# EAGLE design USB3 Hub (EAGLE 6.6.0)
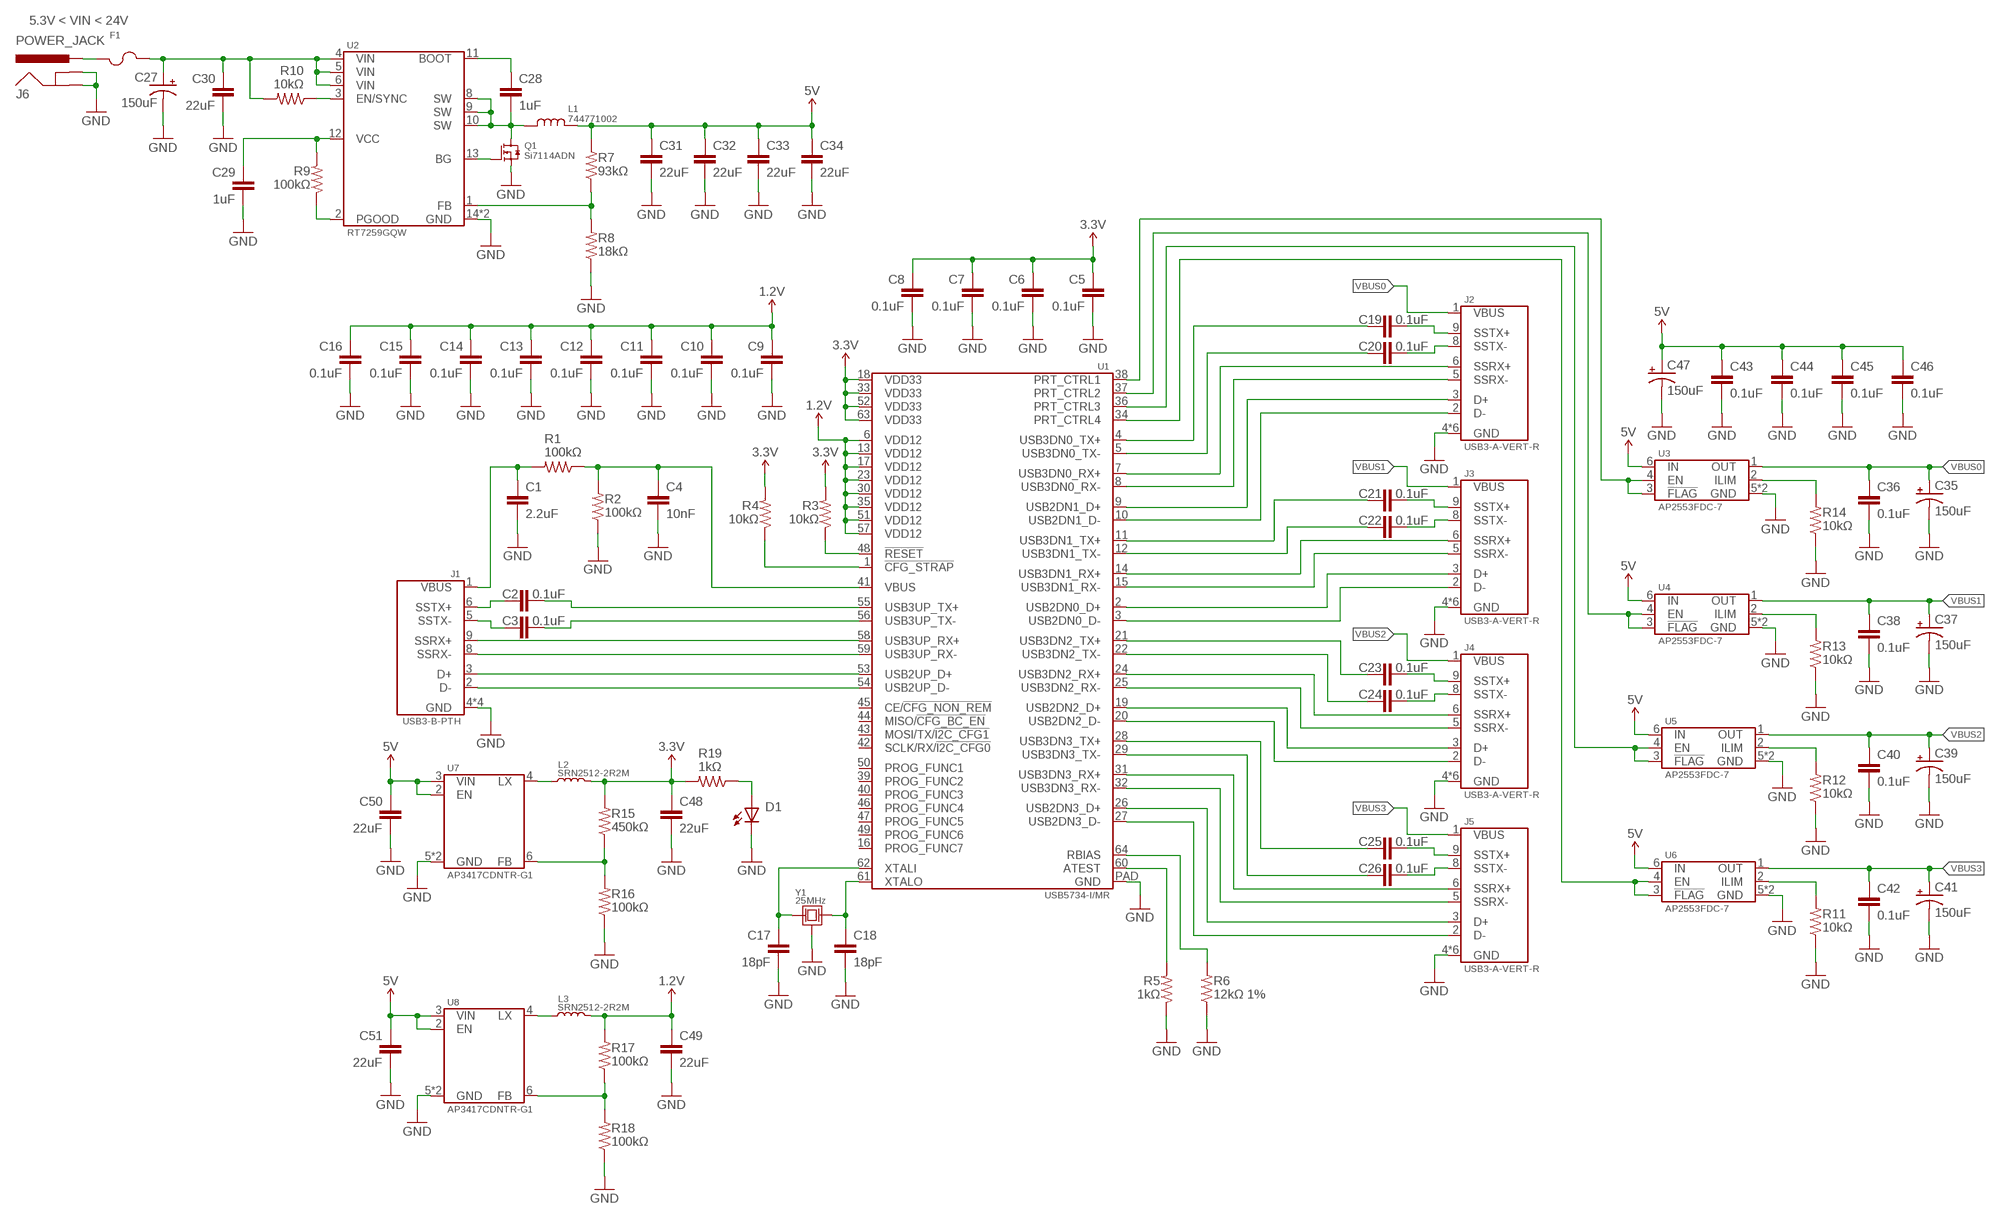
[diagram p0: schematic, sheet 1]

## Parts
C1  2.2uF  CAP-0603  [0603-CAP]
C2  0.1uF  CAP-0603  [0603-CAP]
C3  0.1uF  CAP-0603  [0603-CAP]
C4  10nF  CAP-0603  [0603-CAP]
C5  0.1uF  CAP-0603  [0603-CAP]
C6  0.1uF  CAP-0603  [0603-CAP]
C7  0.1uF  CAP-0603  [0603-CAP]
C8  0.1uF  CAP-0603  [0603-CAP]
C9  0.1uF  CAP-0603  [0603-CAP]
C10  0.1uF  CAP-0603  [0603-CAP]
C11  0.1uF  CAP-0603  [0603-CAP]
C12  0.1uF  CAP-0603  [0603-CAP]
C13  0.1uF  CAP-0603  [0603-CAP]
C14  0.1uF  CAP-0603  [0603-CAP]
C15  0.1uF  CAP-0603  [0603-CAP]
C16  0.1uF  CAP-0603  [0603-CAP]
C17  18pF  CAP-0603  [0603-CAP]
C18  18pF  CAP-0603  [0603-CAP]
C19  0.1uF  CAP-0603  [0603-CAP]
C20  0.1uF  CAP-0603  [0603-CAP]
C21  0.1uF  CAP-0603  [0603-CAP]
C22  0.1uF  CAP-0603  [0603-CAP]
C23  0.1uF  CAP-0603  [0603-CAP]
C24  0.1uF  CAP-0603  [0603-CAP]
C25  0.1uF  CAP-0603  [0603-CAP]
C26  0.1uF  CAP-0603  [0603-CAP]
C27  150uF  CAP_POL-6.6X6.6  [CAP_POL-6.6X6.6]
C28  1uF  CAP-0603  [0603-CAP]
C29  1uF  CAP-0603  [0603-CAP]
C30  22uF  CAP-0603  [0603-CAP]
C31  22uF  CAP-0603  [0603-CAP]
C32  22uF  CAP-0603  [0603-CAP]
C33  22uF  CAP-0603  [0603-CAP]
C34  22uF  CAP-0603  [0603-CAP]
C35  150uF  CAP_POL-6.6X6.6  [CAP_POL-6.6X6.6]
C36  0.1uF  CAP-0603  [0603-CAP]
C37  150uF  CAP_POL-6.6X6.6  [CAP_POL-6.6X6.6]
C38  0.1uF  CAP-0603  [0603-CAP]
C39  150uF  CAP_POL-6.6X6.6  [CAP_POL-6.6X6.6]
C40  0.1uF  CAP-0603  [0603-CAP]
C41  150uF  CAP_POL-6.6X6.6  [CAP_POL-6.6X6.6]
C42  0.1uF  CAP-0603  [0603-CAP]
C43  0.1uF  CAP-0603  [0603-CAP]
C44  0.1uF  CAP-0603  [0603-CAP]
C45  0.1uF  CAP-0603  [0603-CAP]
C46  0.1uF  CAP-0603  [0603-CAP]
C47  150uF  CAP_POL-6.6X6.6  [CAP_POL-6.6X6.6]
C48  22uF  CAP-0603  [0603-CAP]
C49  22uF  CAP-0603  [0603-CAP]
C50  22uF  CAP-0603  [0603-CAP]
C51  22uF  CAP-0603  [0603-CAP]
D1  LED-0805  [0805-LED]
F1  PTC-1812  [1812-PTC]
J1  USB3-B-PTH  [GSB4211311WEU]
J2  USB3-A-VERT-R  [GSB4116341HR]
J3  USB3-A-VERT-R  [GSB4116341HR]
J4  USB3-A-VERT-R  [GSB4116341HR]
J5  USB3-A-VERT-R  [GSB4116341HR]
J6  POWER_JACK  [BARREL-POWER_2.1MMX5.5MM]
L1  744771002  INDUCTOR-744771002  [744771002]
L2  SRN2512-2R2M  [SRN2512]
L3  SRN2512-2R2M  [SRN2512]
Q1  Si7114ADN  N-MOSFET  [POWERPAK]
R1  100kΩ  RESISTOR-0603  [0603-CAP]
R2  100kΩ  RESISTOR-0603  [0603-CAP]
R3  10kΩ  RESISTOR-0603  [0603-CAP]
R4  10kΩ  RESISTOR-0603  [0603-CAP]
R5  1kΩ  RESISTOR-0603  [0603-CAP]
R6  12kΩ 1%  RESISTOR-0603  [0603-CAP]
R7  93kΩ  RESISTOR-0603  [0603-CAP]
R8  18kΩ  RESISTOR-0603  [0603-CAP]
R9  100kΩ  RESISTOR-0603  [0603-CAP]
R10  10kΩ  RESISTOR-0603  [0603-CAP]
R11  10kΩ  RESISTOR-0603  [0603-CAP]
R12  10kΩ  RESISTOR-0603  [0603-CAP]
R13  10kΩ  RESISTOR-0603  [0603-CAP]
R14  10kΩ  RESISTOR-0603  [0603-CAP]
R15  450kΩ  RESISTOR-0603  [0603-CAP]
R16  100kΩ  RESISTOR-0603  [0603-CAP]
R17  100kΩ  RESISTOR-0603  [0603-CAP]
R18  100kΩ  RESISTOR-0603  [0603-CAP]
R19  1kΩ  RESISTOR-0603  [0603-CAP]
U1  USB5734-I/MR  [VQFN-64-9MM]
U2  RT7259GQW  [WDFN-14-4X3]
U3  AP2553FDC-7  [UDFN6-2020]
U4  AP2553FDC-7  [UDFN6-2020]
U5  AP2553FDC-7  [UDFN6-2020]
U6  AP2553FDC-7  [UDFN6-2020]
U7  AP3417CDNTR-G1  [UDFN6-2020]
U8  AP3417CDNTR-G1  [UDFN6-2020]
Y1  25MHz  CRYSTAL-3.2X2.5  [FA-238]

## Nets
1.2V: C9.1 C10.1 C11.1 C12.1 C13.1 C14.1 C15.1 C16.1 C49.1 L3.2 R17.2 U1.6(VDD12) U1.13(VDD12) U1.17(VDD12) U1.23(VDD12) U1.30(VDD12) U1.35(VDD12) U1.51(VDD12) U1.57(VDD12)
3.3V: C5.1 C6.1 C7.1 C8.1 C48.1 L2.2 R3.2 R4.2 R15.2 R19.2 U1.18(VDD33) U1.33(VDD33) U1.52(VDD33) U1.63(VDD33)
5V: C31.1 C32.1 C33.1 C34.1 C43.1 C44.1 C45.1 C46.1 C47.+ C50.1 C51.1 L1.P$2 R7.2 U3.6(IN) U4.6(IN) U5.6(IN) U6.6(IN) U7.2(EN) U7.3(VIN) U8.2(EN) U8.3(VIN)
_T0_N: C20.2 J2.8(SSTX-)
_T0_P: C19.2 J2.9(SSTX+)
_T1_N: C22.2 J3.8(SSTX-)
_T1_P: C21.2 J3.9(SSTX+)
_T2_N: C24.2 J4.8(SSTX-)
_T2_P: C23.2 J4.9(SSTX+)
_T3_N: C26.2 J5.8(SSTX-)
_T3_P: C25.2 J5.9(SSTX+)
_T_N: C3.1 J1.5(SSTX-)
_T_P: C2.1 J1.6(SSTX+)
D0_N: J2.2(D-) U1.10(USB2DN1_D-)
D0_P: J2.3(D+) U1.9(USB2DN1_D+)
D1_N: J3.2(D-) U1.3(USB2DN0_D-)
D1_P: J3.3(D+) U1.2(USB2DN0_D+)
D2_N: J4.2(D-) U1.20(USB2DN2_D-)
D2_P: J4.3(D+) U1.19(USB2DN2_D+)
D3_N: J5.2(D-) U1.27(USB2DN3_D-)
D3_P: J5.3(D+) U1.26(USB2DN3_D+)
D_N: J1.2(D-) U1.54(USB2UP_D-)
D_P: J1.3(D+) U1.53(USB2UP_D+)
GND: C1.2 C4.2 C5.2 C6.2 C7.2 C8.2 C9.2 C10.2 C11.2 C12.2 C13.2 C14.2 C15.2 C16.2 C17.2 C18.2 C27.- C29.2 C30.2 C31.2 C32.2 C33.2 C34.2 C35.- C36.2 C37.- C38.2 C39.- C40.2 C41.- C42.2 C43.2 C44.2 C45.2 C46.2 C47.- C48.2 C49.2 C50.2 C51.2 D1.C J1.4(GND) J1.7(GND) J1.P$10(GND) J1.P$11(GND) J2.4(GND) J2.7(GND) J2.P$1(GND) J2.P$2(GND) J2.P$3(GND) J2.P$4(GND) J3.4(GND) J3.7(GND) J3.P$1(GND) J3.P$2(GND) J3.P$3(GND) J3.P$4(GND) J4.4(GND) J4.7(GND) J4.P$1(GND) J4.P$2(GND) J4.P$3(GND) J4.P$4(GND) J5.4(GND) J5.7(GND) J5.P$1(GND) J5.P$2(GND) J5.P$3(GND) J5.P$4(GND) J6.2(GND) J6.3(GNDBREAK) Q1.1(SOURCE) Q1.2(SOURCE) Q1.3(SOURCE) R2.1 R5.1 R6.1 R8.1 R11.1 R12.1 R13.1 R14.1 R16.1 R18.1 U1.PAD(GND) U2.14(GND) U2.PAD(GND) U3.5(GND) U3.PAD(GND) U4.5(GND) U4.PAD(GND) U5.5(GND) U5.PAD(GND) U6.5(GND) U6.PAD(GND) U7.5(GND) U7.PAD(GND) U8.5(GND) U8.PAD(GND) Y1.2(GND) Y1.4(GND)
N$1: F1.1 J6.1(PWR)
N$2: C27.+ C30.1 F1.2 R10.2 U2.4(VIN) U2.5(VIN) U2.6(VIN)
N$3: R7.1 R8.2 U2.1(FB)
N$4: Q1.4(GATE) U2.13(BG)
N$5: C1.1 J1.1(VBUS) R1.2
N$6: R12.2 U5.2(ILIM)
N$7: C28.2 L1.P$1 Q1.5(DRAIN) Q1.6(DRAIN) Q1.7(DRAIN) Q1.8(DRAIN) Q1.9(DRAIN) Q1.10(DRAIN) Q1.11(DRAIN) U2.8(SW) U2.9(SW) U2.10(SW)
N$8: C28.1 U2.11(BOOT)
N$9: C29.1 R9.2 U2.12(VCC)
N$10: C4.1 R1.1 R2.2 U1.41(VBUS)
N$11: R9.1 U2.2(PGOOD)
N$12: R3.1 U1.48(!RESET)
N$13: R4.1 U1.1(!CFG_STRAP)
N$14: C17.1 U1.62(XTALI) Y1.1
N$15: C18.1 U1.61(XTALO) Y1.3
N$16: R5.2 U1.60(ATEST)
N$17: R6.2 U1.64(RBIAS)
N$18: R10.1 U2.3(EN/SYNC)
N$19: R11.2 U6.2(ILIM)
N$20: L3.1 U8.4(LX)
N$22: U1.36(PRT_CTRL3) U5.3(!FLAG) U5.4(EN)
N$23: U1.38(PRT_CTRL1) U3.3(!FLAG) U3.4(EN)
N$24: U1.37(PRT_CTRL2) U4.3(!FLAG) U4.4(EN)
N$25: R14.2 U3.2(ILIM)
N$26: R17.1 R18.2 U8.6(FB)
N$27: L2.1 U7.4(LX)
N$28: R13.2 U4.2(ILIM)
N$29: U1.34(PRT_CTRL4) U6.3(!FLAG) U6.4(EN)
N$31: R15.1 R16.2 U7.6(FB)
N$35: D1.A R19.1
R0_N: J2.5(SSRX-) U1.8(USB3DN0_RX-)
R0_P: J2.6(SSRX+) U1.7(USB3DN0_RX+)
R1_N: J3.5(SSRX-) U1.15(USB3DN1_RX-)
R1_P: J3.6(SSRX+) U1.14(USB3DN1_RX+)
R2_N: J4.5(SSRX-) U1.25(USB3DN2_RX-)
R2_P: J4.6(SSRX+) U1.24(USB3DN2_RX+)
R3_N: J5.5(SSRX-) U1.32(USB3DN3_RX-)
R3_P: J5.6(SSRX+) U1.31(USB3DN3_RX+)
R_N: J1.8(SSRX-) U1.59(USB3UP_RX-)
R_P: J1.9(SSRX+) U1.58(USB3UP_RX+)
T0_N: C20.1 U1.5(USB3DN0_TX-)
T0_P: C19.1 U1.4(USB3DN0_TX+)
T1_N: C22.1 U1.12(USB3DN1_TX-)
T1_P: C21.1 U1.11(USB3DN1_TX+)
T2_N: C24.1 U1.22(USB3DN2_TX-)
T2_P: C23.1 U1.21(USB3DN2_TX+)
T3_N: C26.1 U1.29(USB3DN3_TX-)
T3_P: C25.1 U1.28(USB3DN3_TX+)
T_N: C3.2 U1.56(USB3UP_TX-)
T_P: C2.2 U1.55(USB3UP_TX+)
VBUS0: C35.+ C36.1 J2.1(VBUS) U3.1(OUT)
VBUS1: C37.+ C38.1 J3.1(VBUS) U4.1(OUT)
VBUS2: C39.+ C40.1 J4.1(VBUS) U5.1(OUT)
VBUS3: C41.+ C42.1 J5.1(VBUS) U6.1(OUT)
Unconnected: U1.16(PROG_FUNC7) U1.39(PROG_FUNC2) U1.40(PROG_FUNC3) U1.42(SCLK/RX/!I2C_CFG0) U1.43(MOSI/TX/!I2C_CFG1) U1.44(MISO/!CFG_BC_EN) U1.45(CE/!CFG_NON_REM) U1.46(PROG_FUNC4) U1.47(PROG_FUNC5) U1.49(PROG_FUNC6) U1.50(PROG_FUNC1)

## Notes on the sheet
- 5.3V < VIN < 24V

## Library data of the parts
C1-C26 C28-C34 C36 C38 C40 C42-C46 C48-C51 = Passives:CAP
C27 C35 C37 C39 C41 C47 = Passives:CAP_POL
D1 = Passives:LED
F1 = Passives:PTC
J1-J5 = Connectors:USB3
J6 = Connectors:POWER_JACK
L1 = Passives:INDUCTOR
L2 L3 = Bourns:SRN2512-2R2M
Q1 = Passives:N-MOSFET
R1-R19 = Passives:RESISTOR
U1 = Microchip:USB5734
U2 = Richtek:RT7259
U3-U6 = Diodes:AP2553
U7 U8 = Diodes:AP3417C
Y1 = Passives:CRYSTAL

## Board
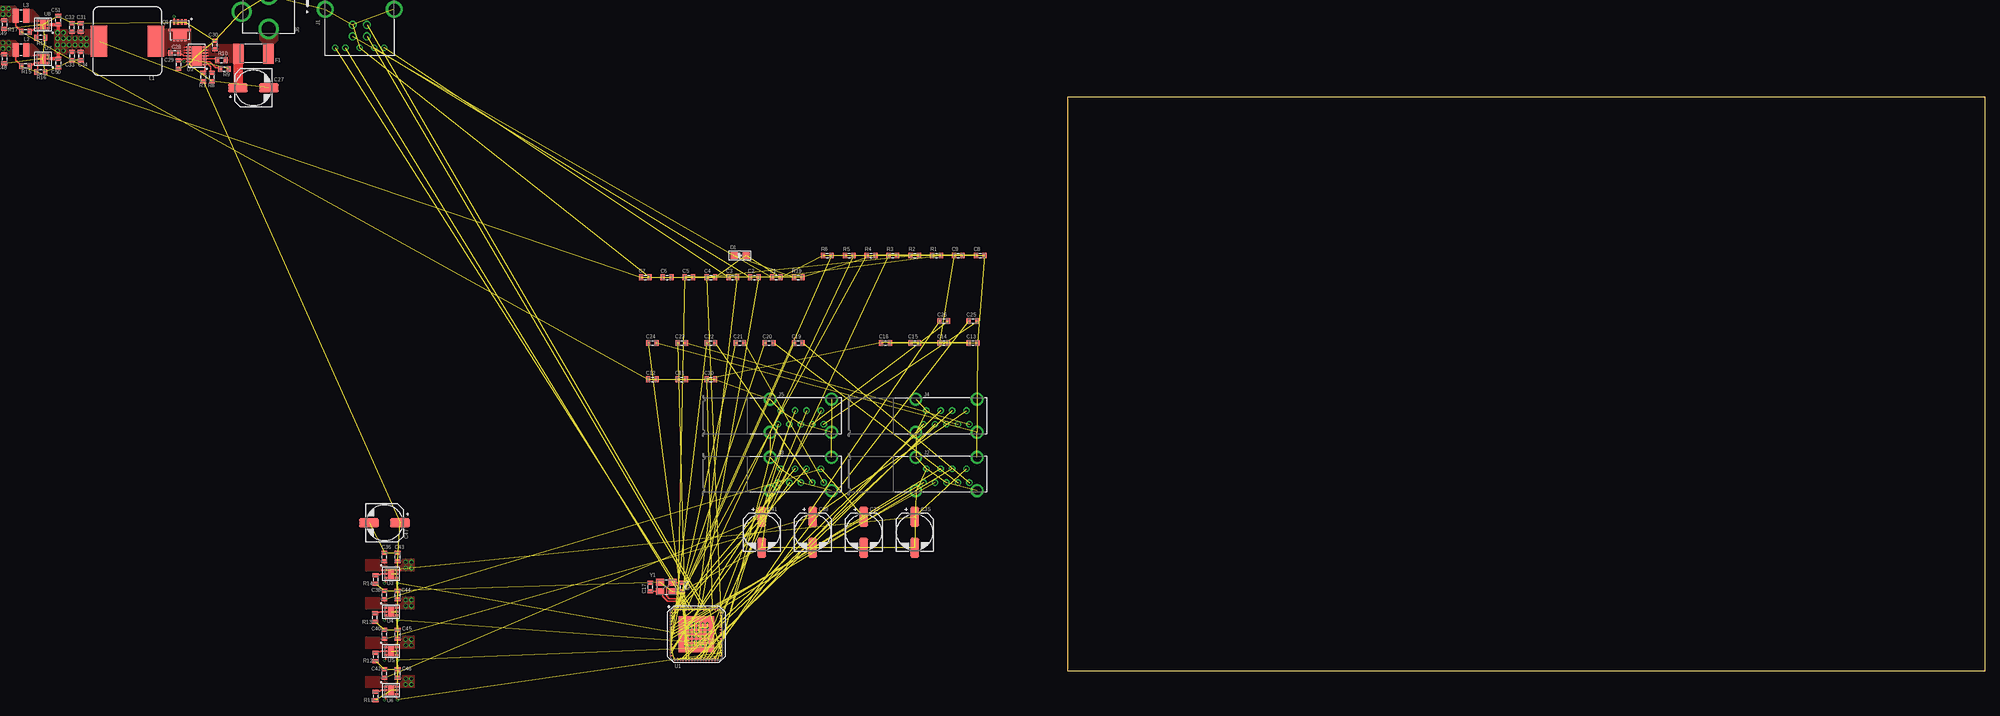
[diagram p1: board, top side]
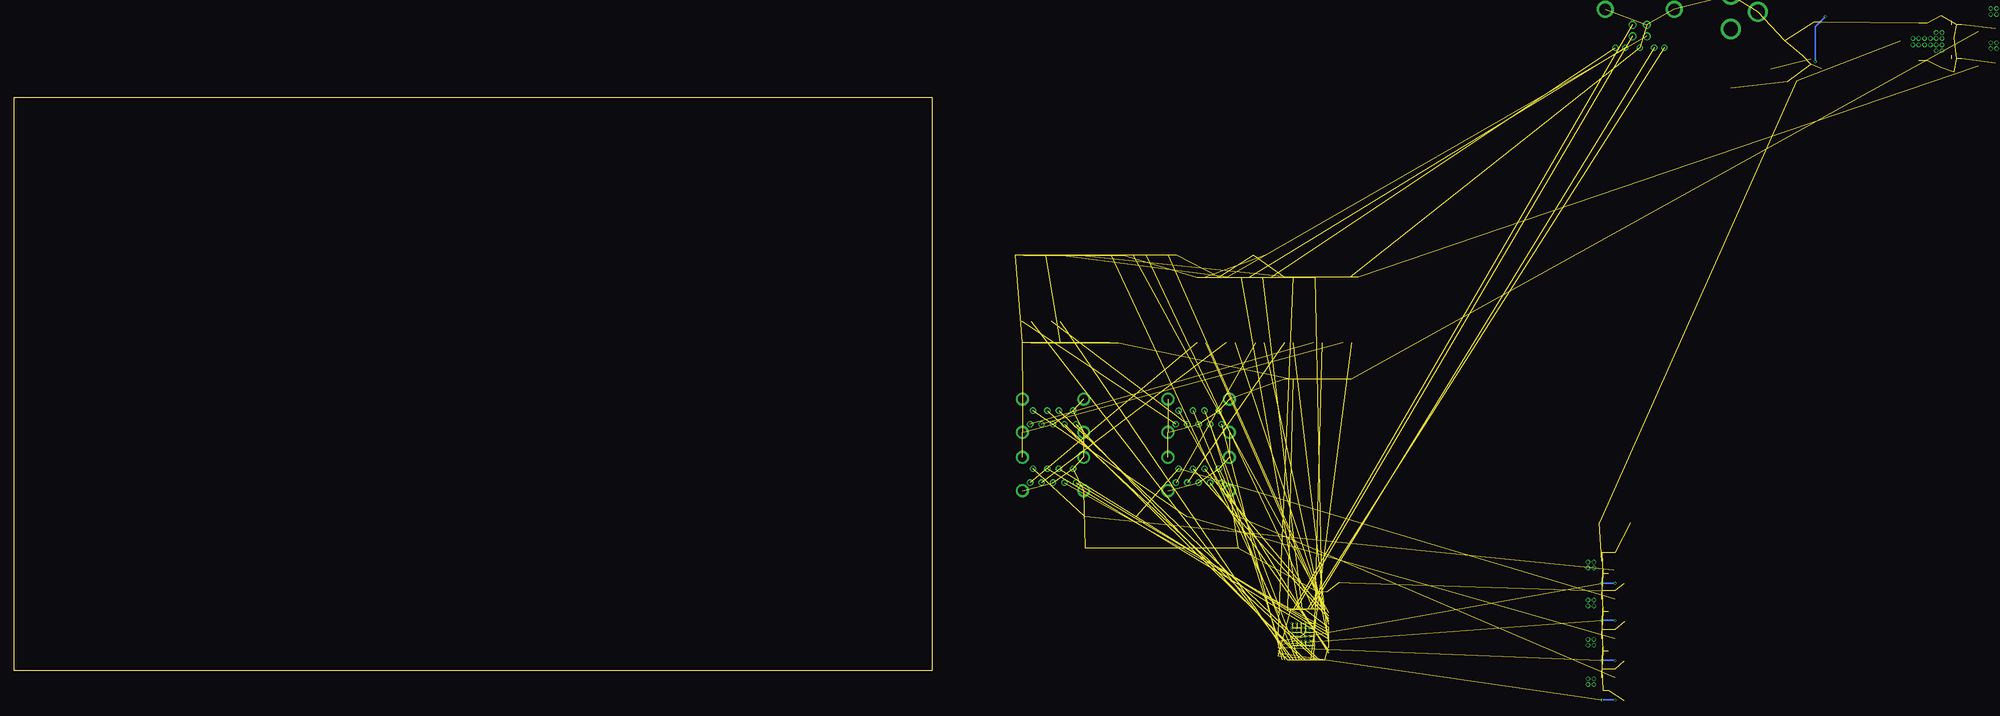
[diagram p2: board, bottom side, seen from below]

Size 160 x 100 mm. Coordinates in mm from the lower left corner, seen from the top.
Outline: 0,0 160,0 160,100 0,100 0,0
Copper layers (1*2*15*16): Top 0.035559375mm / dielectric 0.17018125mm / Route2 0.01778125mm / dielectric 47mil / Route15 0.01778125mm / dielectric 0.17018125mm / Bottom 0.035559375mm
Design rules "OSHPark-4layer *": minimum track width 5mil, minimum drill 10mil, track to track 5mil, track to pad 5mil, pad to pad 5mil, via to via 5mil, smd to smd 5mil, copper to edge 15mil, drill to drill 6mil, minimum pad ring 4mil, minimum via ring 4mil, stop-mask expansion 2.5mil, vias tented up to drill 20mil, thermal gap 10mil

### Footprints (pad centres in the part's own frame; a part is rotated, then mirrored left to right if it is on the bottom)
0603-CAP = smd 0.7 x 1: 1 -0.75,0; 2 0.75,0
CAP_POL-6.6X6.6 = smd 1.6 x 3.5: + 0,2.7; - 0,-2.7
0805-LED = smd 1.2 x 1.2: A -1.05,0; C 1.05,0
1812-PTC = smd 1.78 x 3.5: 1 -2.615,0; 2 2.615,0
GSB4211311WEU = drill 0.92: 1 1.25,-2; 2 -1.25,-2; 3 -1.25,-4; 4 1.25,-4 | drill 0.7: 5 -4.25,0; 6 -2.5,0; 7 0,0; 8 2.5,0; 9 4.25,0 | drill 2: P$10 -6.02,-6.71; P$11 6.02,-6.71
GSB4116341HR = drill 0.7 pad 1.1: 1 12.85,0.9; 2 10.35,0.9; 3 8.35,0.9; 4 5.85,0.9; 5 5.35,-1.5; 6 7.35,-1.5; 7 9.35,-1.5; 8 11.35,-1.5; 9 13.35,-1.5 | drill 1.5 pad 2.1: P$1 14.7,2.9; P$2 4,2.9; P$3 4,-2.9; P$4 14.7,-2.9
BARREL-POWER_2.1MMX5.5MM = drill 2.5: 1 0,-6.5; 2 0,-0.5; 3 -4.7,-3.5
744771002 = smd 2.9 x 5.4: P$1 -4.95,0; P$2 4.95,0
SRN2512 = smd 1.05 x 2.4: 1 -0.925,0; 2 0.925,0
POWERPAK = smd 0.991 x 0.406: 1 -1.435,0.991; 2 -1.435,0.33; 3 -1.435,-0.33; 4 -1.435,-0.991 | smd 0.457 x 0.737: 5 -0.076,-1.562; 10 -0.076,1.562 | smd 0.508 x 0.406: 6 1.676,-0.991; 7 1.676,-0.33; 8 1.676,0.33; 9 1.676,0.991 | smd 1.727 x 2.388: 11 0.559,0
VQFN-64-9MM = smd 0.7 x 0.3: 1 -4.4,3.75; 2 -4.4,3.25; 3 -4.4,2.75; 4 -4.4,2.25; 5 -4.4,1.75; 6 -4.4,1.25; 7 -4.4,0.75; 8 -4.4,0.25; 9 -4.4,-0.25; 10 -4.4,-0.75; 11 -4.4,-1.25; 12 -4.4,-1.75; 13 -4.4,-2.25; 14 -4.4,-2.75; 15 -4.4,-3.25; 16 -4.4,-3.75; 33 4.4,-3.75; 34 4.4,-3.25; 35 4.4,-2.75; 36 4.4,-2.25; 37 4.4,-1.75; 38 4.4,-1.25; 39 4.4,-0.75; 40 4.4,-0.25; 41 4.4,0.25; 42 4.4,0.75; 43 4.4,1.25; 44 4.4,1.75; 45 4.4,2.25; 46 4.4,2.75; 47 4.4,3.25; 48 4.4,3.75 | smd 0.3 x 0.7: 17 -3.75,-4.4; 18 -3.25,-4.4; 19 -2.75,-4.4; 20 -2.25,-4.4; 21 -1.75,-4.4; 22 -1.25,-4.4; 23 -0.75,-4.4; 24 -0.25,-4.4; 25 0.25,-4.4; 26 0.75,-4.4; 27 1.25,-4.4; 28 1.75,-4.4; 29 2.25,-4.4; 30 2.75,-4.4; 31 3.25,-4.4; 32 3.75,-4.4; 49 3.75,4.4; 50 3.25,4.4; 51 2.75,4.4; 52 2.25,4.4; 53 1.75,4.4; 54 1.25,4.4; 55 0.75,4.4; 56 0.25,4.4; 57 -0.25,4.4; 58 -0.75,4.4; 59 -1.25,4.4; 60 -1.75,4.4; 61 -2.25,4.4; 62 -2.75,4.4; 63 -3.25,4.4; 64 -3.75,4.4 | smd 6.2 x 6.2: PAD 0,0
WDFN-14-4X3 = smd 0.7 x 0.3: 1 -1.4,1.5; 2 -1.4,1; 3 -1.4,0.5; 4 -1.4,0; 5 -1.4,-0.5; 6 -1.4,-1; 7 -1.4,-1.5; 8 1.4,-1.5; 9 1.4,-1; 10 1.4,-0.5; 11 1.4,0; 12 1.4,0.5; 13 1.4,1; 14 1.4,1.5 | smd 1.7 x 3.375: PAD 0,0
UDFN6-2020 = smd 0.525 x 0.35: 1 -0.938,0.65; 2 -0.938,0; 3 -0.938,-0.65; 4 0.938,-0.65; 5 0.938,0; 6 0.938,0.65 | smd 1 x 1.65: PAD 0,0
FA-238 = smd 1.4 x 1.2: 1 -1.1,-0.8; 2 1.1,-0.8; 3 1.1,0.8; 4 -1.1,0.8

### Placement (x,y rotation side)
C1  -50.8,68.58 0 top  (outside the outline)
C2  -54.61,68.58 0 top  (outside the outline)
C3  -58.42,68.58 0 top  (outside the outline)
C4  -62.23,68.58 0 top  (outside the outline)
C5  -66.04,68.58 0 top  (outside the outline)
C6  -69.85,68.58 0 top  (outside the outline)
C7  -73.66,68.58 0 top  (outside the outline)
C8  -15.24,72.39 0 top  (outside the outline)
C9  -19.05,72.39 0 top  (outside the outline)
C10  -62.23,50.8 0 top  (outside the outline)
C11  -67.31,50.8 0 top  (outside the outline)
C12  -72.39,50.8 0 top  (outside the outline)
C13  -16.51,57.15 0 top  (outside the outline)
C14  -21.59,57.15 0 top  (outside the outline)
C15  -26.67,57.15 0 top  (outside the outline)
C16  -31.75,57.15 0 top  (outside the outline)
C17  -72.77,14.61 90 top  (outside the outline)
C18  -67.18,14.61 270 top  (outside the outline)
C19  -46.99,57.15 0 top  (outside the outline)
C20  -52.07,57.15 0 top  (outside the outline)
C21  -57.15,57.15 0 top  (outside the outline)
C22  -62.23,57.15 0 top  (outside the outline)
C23  -67.31,57.15 0 top  (outside the outline)
C24  -72.39,57.15 0 top  (outside the outline)
C25  -16.51,60.96 0 top  (outside the outline)
C26  -21.59,60.96 0 top  (outside the outline)
C27  -141.99,101.6 90 top  (outside the outline)
C28  -155.7,107.7 180 top  (outside the outline)
C29  -155.07,105.66 270 top  (outside the outline)
C30  -148.72,109.09 90 top  (outside the outline)
C31  -172.09,112.14 90 top  (outside the outline)
C32  -173.61,112.14 90 top  (outside the outline)
C33  -173.61,107.19 270 top  (outside the outline)
C34  -172.09,107.19 270 top  (outside the outline)
C35  -26.67,24.13 0 top  (outside the outline)
C36  -119.13,19.81 90 top  (outside the outline)
C37  -35.56,24.13 0 top  (outside the outline)
C38  -119.13,13.21 90 top  (outside the outline)
C39  -44.45,24.13 0 top  (outside the outline)
C40  -119.13,6.35 90 top  (outside the outline)
C41  -53.34,24.13 0 top  (outside the outline)
C42  -119.13,-0.51 90 top  (outside the outline)
C43  -116.84,19.81 90 top  (outside the outline)
C44  -116.84,13.21 90 top  (outside the outline)
C45  -116.84,6.35 90 top  (outside the outline)
C46  -116.84,-0.51 90 top  (outside the outline)
C47  -119.13,25.78 270 top  (outside the outline)
C48  -185.42,106.68 270 top  (outside the outline)
C49  -185.42,112.65 270 top  (outside the outline)
C50  -176.02,105.92 270 top  (outside the outline)
C51  -176.02,113.41 90 top  (outside the outline)
D1  -57.15,72.39 0 top  (outside the outline)
F1  -141.99,107.57 180 top  (outside the outline)
J1  -123.44,108.58 180 top  (outside the outline)
J2  -30.48,34.29 0 top  (outside the outline)
J3  -55.88,34.29 0 top  (outside the outline)
J4  -30.48,44.45 0 top  (outside the outline)
J5  -55.88,44.45 0 top  (outside the outline)
J6  -139.32,118.36 0 top  (outside the outline)
L1  -163.96,109.73 180 top  (outside the outline)
L2  -182.5,108.2 180 top  (outside the outline)
L3  -182.5,114.17 180 top  (outside the outline)
Q1  -154.81,111.63 270 top  (outside the outline)
R1  -22.86,72.39 0 top  (outside the outline)
R2  -26.67,72.39 0 top  (outside the outline)
R3  -30.48,72.39 0 top  (outside the outline)
R4  -34.29,72.39 0 top  (outside the outline)
R5  -38.1,72.39 0 top  (outside the outline)
R6  -41.91,72.39 0 top  (outside the outline)
R7  -150.75,103.5 270 top  (outside the outline)
R8  -149.22,103.5 90 top  (outside the outline)
R9  -147.07,104.9 0 top  (outside the outline)
R10  -147.57,106.43 0 top  (outside the outline)
R11  -120.65,-4.45 90 top  (outside the outline)
R12  -120.65,2.41 90 top  (outside the outline)
R13  -120.78,9.27 90 top  (outside the outline)
R14  -120.65,15.88 90 top  (outside the outline)
R15  -181.74,105.41 180 top  (outside the outline)
R16  -179.07,104.39 180 top  (outside the outline)
R17  -181.74,111.38 180 top  (outside the outline)
R18  -179.07,110.36 180 top  (outside the outline)
R19  -46.99,68.58 0 top  (outside the outline)
U1  -64.77,6.35 0 top  (outside the outline)
U2  -151.89,107.19 180 top  (outside the outline)
U3  -117.98,16.89 0 top  (outside the outline)
U4  -117.98,10.29 0 top  (outside the outline)
U5  -117.98,3.43 0 top  (outside the outline)
U6  -117.98,-3.43 0 top  (outside the outline)
U7  -178.69,106.68 180 top  (outside the outline)
U8  -178.69,112.65 180 top  (outside the outline)
Y1  -69.98,14.61 0 top  (outside the outline)

### Tracks (layer width: path | path; a pad name or v marks a point on that pad's centre or on a via)
1.2V  (via drill 0.51)  (16 unrouted)
  Top 0.254: R17.2 -182.49,111.49 -183.42,112.43 L3.2
  other vias: -185.67,114.43 -184.66,114.43 -184.66,115.44 -185.67,115.44
  pour Top (no thermals): -184.4,113.16 -184.4,115.82 -183.64,115.82 -183.13,115.32 -183.13,113.16
  pour Top: -183.13,113.16 -186.06,113.16 -186.06,115.82 -183.64,115.82 -183.13,115.32
3.3V  (via drill 0.51)  (11 unrouted)
  Top 0.254: R15.2 -182.49,105.53 -183.42,106.46 L2.2
  other vias: -184.66,108.46 -184.66,109.47 -185.67,109.47 -185.67,108.46
  pour Top: -183.13,107.19 -186.06,107.19 -186.06,109.86 -183.64,109.86 -183.13,109.35
  pour Top (no thermals): -184.4,107.19 -184.4,109.86 -183.64,109.86 -183.13,109.35 -183.13,107.19
5V  (via drill 0.51)  (8 unrouted)
  Top 0.254: -177.29,106.68 U7.2 | -177.29,112.65 U8.2 | U3.6 -116.32,17.54
  Top 0.635: C50.1 -176.03,106.68 | -176.03,106.68 -177.29,106.68 | C51.1 -176.03,112.65 | -176.03,112.65 -177.29,112.65 | -176.03,112.65 -176.03,111.01 | -176.03,106.68 -176.03,108.19
  other vias: -175.13,108.08 -176.15,108.08 -176.15,109.09 -175.13,109.09 -175.13,110.24 -176.15,110.24 -176.15,111.25 -175.13,111.25 -174.12,109.09 -174.12,110.24 -173.1,110.24 -173.1,109.09 -172.09,109.09 -172.09,110.24 -171.07,110.24 -171.07,109.09 -114.43,17.91 -115.44,17.91 -115.44,18.92 -114.43,18.92 -114.43,12.32 -114.43,11.3 -115.44,11.3 -115.44,12.32 -114.43,5.46 -114.43,4.45 -115.44,4.45 -115.44,5.46 -114.43,-1.4 -114.43,-2.41 -115.44,-2.41 -115.44,-1.4
  pour Top: -167.64,107.19 -170.18,107.19 -170.18,107.57 -176.66,107.57 -176.66,111.76 -170.18,111.76 -170.18,112.27 -167.64,112.27
  pour Top (no thermals): -171.2,107.57 -169.93,107.57 -169.93,111.76 -171.2,111.76
  pour Top: -113.92,19.43 -113.92,17.4 -117.22,17.4 -117.22,19.43
  pour Top: -113.92,12.83 -113.92,10.79 -117.22,10.79 -117.22,12.83
  pour Top: -113.92,5.97 -113.92,3.94 -117.22,3.94 -117.22,5.97
  pour Top: -113.92,-0.89 -113.92,-2.92 -117.22,-2.92 -117.22,-0.89
_T0_N  (1 unrouted)
_T0_P  (1 unrouted)
_T1_N  (1 unrouted)
_T1_P  (1 unrouted)
_T2_N  (1 unrouted)
_T2_P  (1 unrouted)
_T3_N  (1 unrouted)
_T3_P  (1 unrouted)
_T_N  (1 unrouted)
_T_P  (1 unrouted)
D0_N  (1 unrouted)
D0_P  (1 unrouted)
D1_N  (1 unrouted)
D1_P  (1 unrouted)
D2_N  (1 unrouted)
D2_P  (1 unrouted)
D3_N  (1 unrouted)
D3_P  (1 unrouted)
D_N  (1 unrouted)
D_P  (1 unrouted)
GND  (via drill 0.25)  (136 unrouted)
  other vias: -65.15,6.73 -65.91,6.73 -65.91,7.49 -65.15,7.49 -64.39,7.49 -64.39,6.73 -63.63,6.73 -63.63,7.49 -64.39,5.97 -63.63,5.97 -63.63,5.21 -64.39,5.21 -65.15,5.21 -65.15,5.97 -65.91,5.97 -65.91,5.21 -65.91,4.45 -65.15,4.45 -64.39,4.45 -63.63,4.45 -62.87,4.45 -62.87,5.21 -62.87,5.97 -62.87,6.73 -62.87,7.49 -62.87,8.26 -63.63,8.26 -64.39,8.26 -65.15,8.26 -65.91,8.26 -66.67,8.26 -66.67,7.49 -66.67,6.73 -66.67,5.97 -66.67,5.21 -66.67,4.45
N$1
  pour Top (no thermals): -137.79,112.14 -137.79,110.04 -139.12,108.71 -139.57,108.71 -140.84,109.99 -140.84,112.14 arc-159
N$2
  Top 0.254: U2.4 -149.86,107.19 | U2.5 -149.85,107.69 | U2.6 -149.89,108.19 | -144.6,102.16 -144.6,101.69 C27.+
  Top 1.651: F1.2 -144.6,102.16
  pour Top: -143.89,109.09 -143.89,106.05 -147.07,106.05 -147.07,107.19 -150.75,107.19 -150.75,108.33 -150.37,108.33 -149.61,109.09
  pour Top (no thermals): -145.03,106.05 -146.05,106.05 -146.05,109.09 -145.03,109.09
N$3
  Top 0.254: R8.2 -149.35,104.39 -149.48,104.52 -149.48,105.28 -149.88,105.69 U2.1 -150.49,104.38 R7.1
N$4  (via drill 0.25)
  Top 0.254: U2.13 v-154.05,106.19 | Q1.4 v-155.8,114.02
  Bottom 0.254: v-154.05,106.19 -154.05,112.27 v-155.8,114.02
N$5  (2 unrouted)
N$6
  Top 0.254: U5.2 -119.76,3.43 -119.89,3.3 -120.51,3.3 R12.2
N$7
  Top 0.254: U2.10 -154.04,107.69 | U2.9 -154.03,108.19 | U2.8 -154.03,108.69
  pour Top: -152.91,107.44 -154.18,107.44 -154.31,107.57 -154.81,107.57 -155.19,107.19 -157.35,107.19 -157.35,111.76 -152.91,111.76
  pour Top (no thermals): -152.91,109.35 -157.23,109.35 -157.23,107.19 -160.27,107.19 -160.27,111.89 -152.91,111.89
N$8
  Top 0.254: U2.11 -154.18,107.19 -154.43,107.44 -154.7,107.44 C28.1
N$9  (1 unrouted)
  Top 0.254: U2.12 -154.3,106.69 -154.43,106.55 -154.93,106.55 C29.1
N$10  (3 unrouted)
N$11
  Top 0.254: U2.2 -149.62,106.19 -148.59,105.16 -148.07,105.16 R9.1
N$12  (1 unrouted)
N$13  (1 unrouted)
N$14
  Top 0.254: U1.62 -67.52,11.39 -68.2,12.06 -69.72,12.06 -70.61,12.95 -70.61,13.34 Y1.1 -71.13,13.86 C17.1
N$15
  Top 0.254: U1.61 -67.02,11.65 -67.94,12.57 -69.47,12.57 -69.98,13.08 -69.98,14.48 -69.05,15.4 Y1.3 -68.83,15.36 C18.1
N$16  (1 unrouted)
N$17  (1 unrouted)
N$18
  Top 0.254: U2.3 -148.46,106.69 R10.1
N$19
  Top 0.254: U6.2 -119.76,-3.43 -119.89,-3.56 -120.51,-3.56 R11.2
N$20
  pour Top: -179.45,113.16 -181.86,113.16 -181.86,115.19 -180.59,115.19 -179.45,114.05
  pour Top (no thermals): -180.59,113.16 -181.36,113.16 -181.36,115.19 -180.59,115.19
N$22  (via drill 0.25)  (1 unrouted)
  Top 0.254: U5.3 -118.92,1.98 v-119.13,1.78 | U5.4 -117.05,1.98 v-116.84,1.78
  Bottom 0.254: v-116.84,1.78 v-119.13,1.78
N$23  (via drill 0.25)  (1 unrouted)
  Top 0.254: U3.4 -117.05,15.45 v-116.84,15.24 | U3.3 -118.92,15.45 v-119.13,15.24
  Bottom 0.254: v-119.13,15.24 v-116.84,15.24
N$24  (via drill 0.25)  (1 unrouted)
  Top 0.254: U4.3 -118.92,8.97 v-119.13,8.76 | U4.4 -117.05,8.97 v-116.84,8.76
  Bottom 0.254: v-119.13,8.76 v-116.84,8.76
N$25
  Top 0.254: U3.2 -119.76,16.89 -119.89,16.76 -120.51,16.76 R14.2
N$26
  Top 0.254: R17.1 -180.73,111.63 -180.47,111.63 -180.1,112 U8.6 -179.63,110.42 R18.2
N$27
  Top 0.254: U7.4 -180.35,107.33
  pour Top: -179.45,107.19 -181.86,107.19 -181.86,109.22 -180.59,109.22 -179.45,108.08
  pour Top (no thermals): -180.59,107.19 -181.36,107.19 -181.36,109.22 -180.59,109.22
N$28
  Top 0.254: U4.2 -119.89,10.29 -120.02,10.16 -120.64,10.16 R13.2
N$29  (via drill 0.25)  (1 unrouted)
  Top 0.254: U6.3 -118.92,-4.88 v-119.13,-5.08 | U6.4 -117.05,-4.88 v-116.84,-5.08
  Bottom 0.254: v-116.84,-5.08 v-119.13,-5.08
N$31
  Top 0.254: R15.1 -180.73,105.66 -180.47,105.66 -180.1,106.03 U7.6 -179.63,104.45 R16.2
N$35  (1 unrouted)
R0_N  (1 unrouted)
R0_P  (1 unrouted)
R1_N  (1 unrouted)
R1_P  (1 unrouted)
R2_N  (1 unrouted)
R2_P  (1 unrouted)
R3_N  (1 unrouted)
R3_P  (1 unrouted)
R_N  (1 unrouted)
R_P  (1 unrouted)
T0_N  (1 unrouted)
T0_P  (1 unrouted)
T1_N  (1 unrouted)
T1_P  (1 unrouted)
T2_N  (1 unrouted)
T2_P  (1 unrouted)
T3_N  (1 unrouted)
T3_P  (1 unrouted)
T_N  (1 unrouted)
T_P  (1 unrouted)
VBUS0  (2 unrouted)
  Top 0.254: U3.1 -119.65,17.54
  pour Top: -118.75,19.3 -118.75,17.4 -122.43,17.4 -122.43,19.3
VBUS1  (2 unrouted)
  pour Top: -118.75,12.7 -118.75,10.79 -122.43,10.79 -122.43,12.7
VBUS2  (2 unrouted)
  pour Top: -118.75,5.84 -118.75,3.94 -122.43,3.94 -122.43,5.84
VBUS3  (2 unrouted)
  pour Top: -118.75,-1.02 -118.75,-2.92 -122.43,-2.92 -122.43,-1.02